# EAGLE design DIP_1_0 (EAGLE 8.3.2)
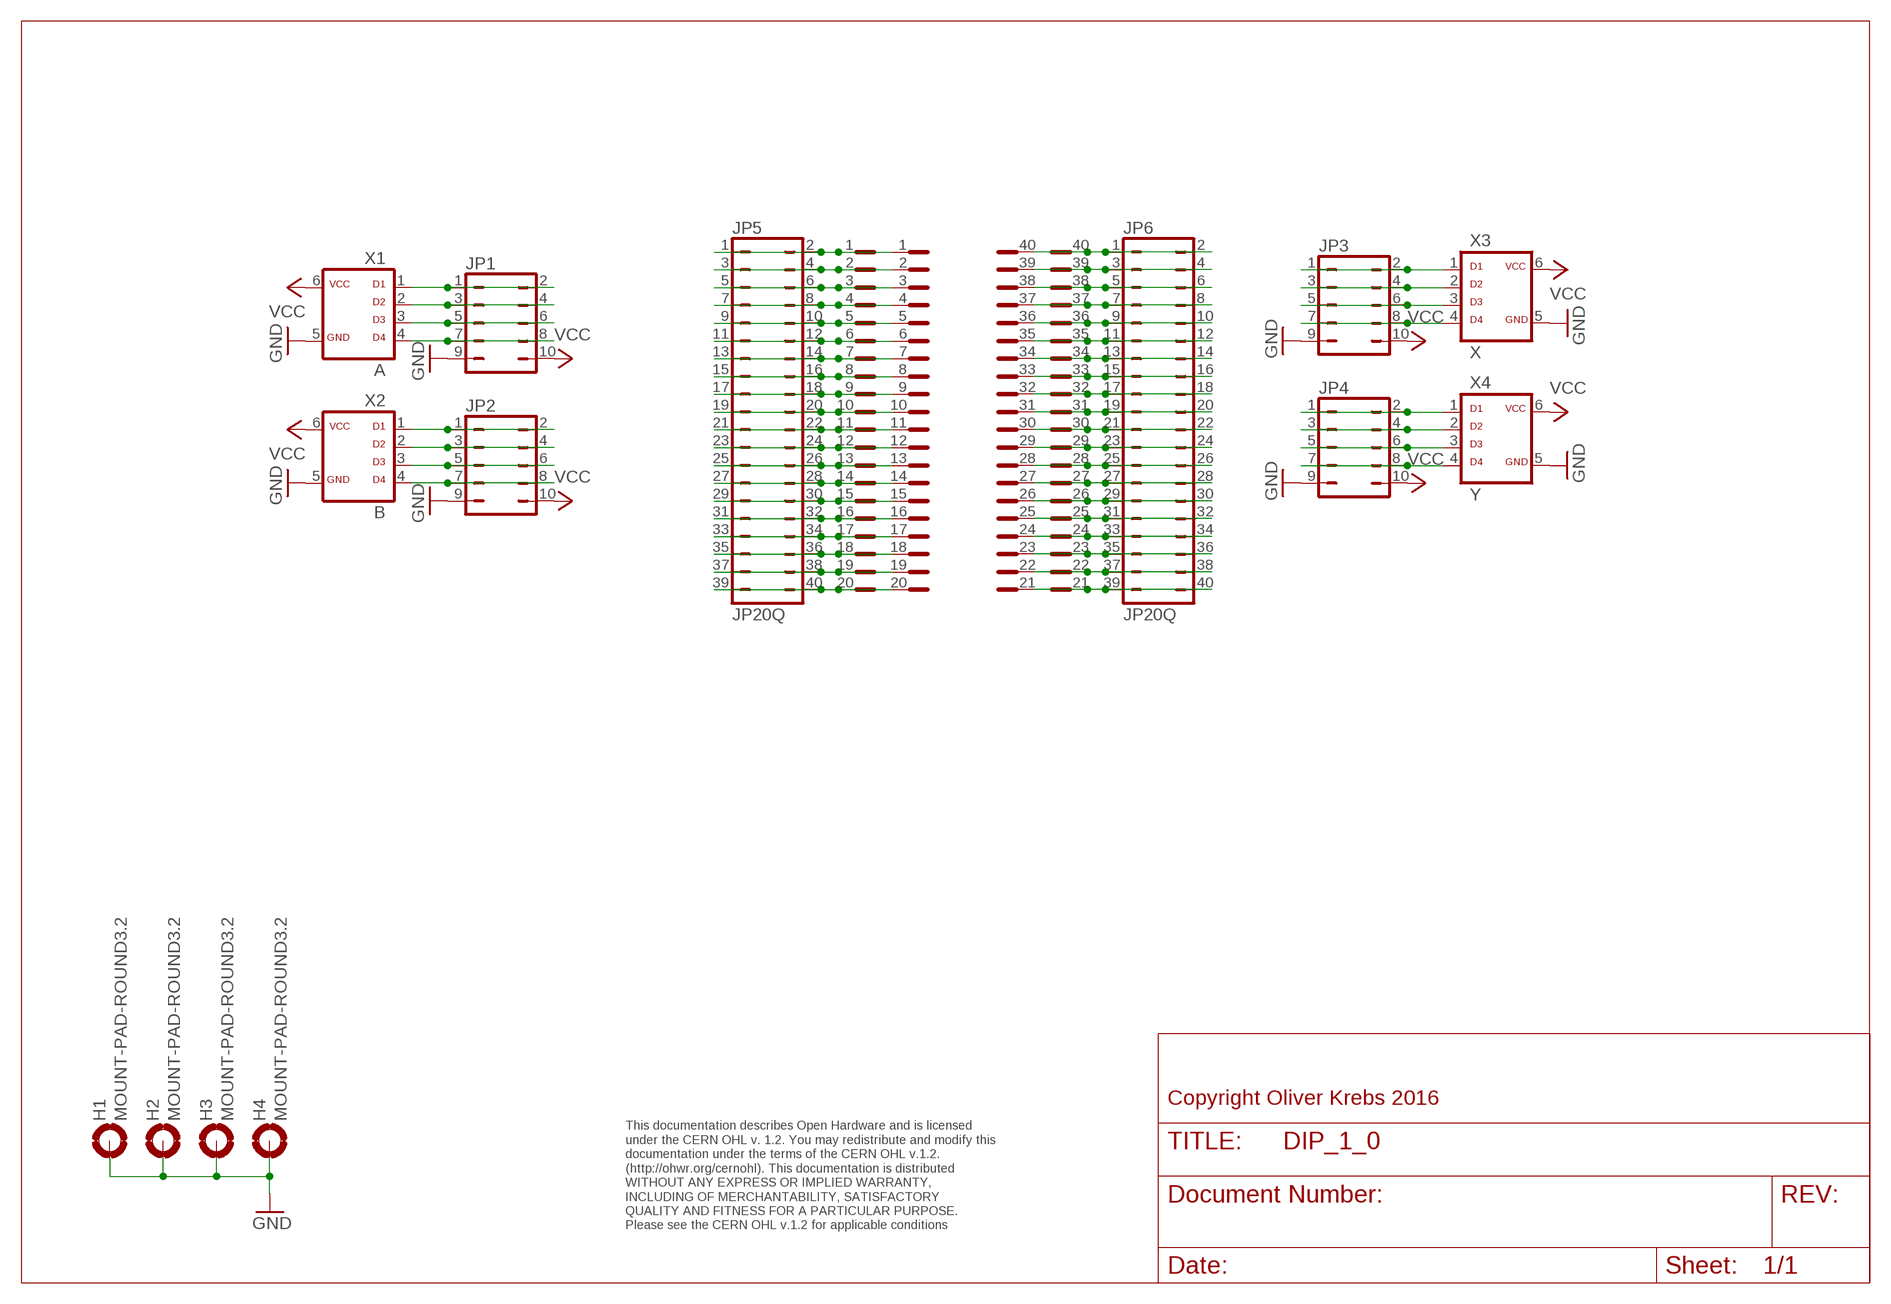
[diagram p0: schematic, sheet 1]

## Parts
H1  MOUNT-PAD-ROUND3.2  [3,2-PAD]
H2  MOUNT-PAD-ROUND3.2  [3,2-PAD]
H3  MOUNT-PAD-ROUND3.2  [3,2-PAD]
H4  MOUNT-PAD-ROUND3.2  [3,2-PAD]
JP1  JP5Q  [JP5Q]
JP2  JP5Q  [JP5Q]
JP3  JP5Q  [JP5Q]
JP4  JP5Q  [JP5Q]
JP5  JP20Q  [JP20Q]
JP6  JP20Q  [JP20Q]
X1  A  ML6D  [ML-6]
X2  B  ML6D  [ML-6]
X3  X  ML6D  [ML-6]
X4  Y  ML6D  [ML-6]
X5  DIL40-3  [DIL40-3]
X6  DIL40-6  [DIL40-6]

## Nets
GND: H1.B3,2(MOUNT) H2.B3,2(MOUNT) H3.B3,2(MOUNT) H4.B3,2(MOUNT) JP1.9 JP2.9 JP3.9 JP4.9 X1.5 X2.5 X3.5 X4.5
N$1: JP3.1 JP3.2 X3.1
N$2: JP3.3 JP3.4 X3.2
N$3: JP3.5 JP3.6 X3.3
N$4: JP3.7 JP3.8 X3.4
N$5: JP4.1 JP4.2 X4.1
N$6: JP4.3 JP4.4 X4.2
N$7: JP4.5 JP4.6 X4.3
N$8: JP4.7 JP4.8 X4.4
N$9: JP1.1 JP1.2 X1.1
N$10: JP1.3 JP1.4 X1.2
N$11: JP1.5 JP1.6 X1.3
N$12: JP1.7 JP1.8 X1.4
N$13: JP2.1 JP2.2 X2.1
N$14: JP2.3 JP2.4 X2.2
N$15: JP2.5 JP2.6 X2.3
N$16: JP2.7 JP2.8 X2.4
N$17: JP5.1 JP5.2 X5.1 X6.1
N$18: JP5.3 JP5.4 X5.2 X6.2
N$19: JP5.5 JP5.6 X5.3 X6.3
N$20: JP5.7 JP5.8 X5.4 X6.4
N$21: JP5.9 JP5.10 X5.5 X6.5
N$22: JP5.11 JP5.12 X5.6 X6.6
N$23: JP5.13 JP5.14 X5.7 X6.7
N$24: JP5.15 JP5.16 X5.8 X6.8
N$25: JP5.17 JP5.18 X5.9 X6.9
N$26: JP5.19 JP5.20 X5.10 X6.10
N$27: JP5.21 JP5.22 X5.11 X6.11
N$28: JP5.23 JP5.24 X5.12 X6.12
N$29: JP5.25 JP5.26 X5.13 X6.13
N$30: JP5.27 JP5.28 X5.14 X6.14
N$31: JP5.29 JP5.30 X5.15 X6.15
N$32: JP5.31 JP5.32 X5.16 X6.16
N$33: JP5.33 JP5.34 X5.17 X6.17
N$34: JP5.35 JP5.36 X5.18 X6.18
N$35: JP5.37 JP5.38 X5.19 X6.19
N$36: JP5.39 JP5.40 X5.20 X6.20
N$37: JP6.1 JP6.2 X5.40 X6.40
N$38: JP6.3 JP6.4 X5.39 X6.39
N$39: JP6.5 JP6.6 X5.38 X6.38
N$40: JP6.7 JP6.8 X5.37 X6.37
N$41: JP6.9 JP6.10 X5.36 X6.36
N$42: JP6.11 JP6.12 X5.35 X6.35
N$43: JP6.13 JP6.14 X5.34 X6.34
N$44: JP6.15 JP6.16 X5.33 X6.33
N$45: JP6.17 JP6.18 X5.32 X6.32
N$46: JP6.19 JP6.20 X5.31 X6.31
N$47: JP6.21 JP6.22 X5.30 X6.30
N$48: JP6.23 JP6.24 X5.29 X6.29
N$49: JP6.25 JP6.26 X5.28 X6.28
N$50: JP6.27 JP6.28 X5.27 X6.27
N$51: JP6.29 JP6.30 X5.26 X6.26
N$52: JP6.31 JP6.32 X5.25 X6.25
N$53: JP6.33 JP6.34 X5.24 X6.24
N$54: JP6.35 JP6.36 X5.23 X6.23
N$55: JP6.37 JP6.38 X5.22 X6.22
N$56: JP6.39 JP6.40 X5.21 X6.21
VCC: JP1.10 JP2.10 JP3.10 JP4.10 X1.6 X2.6 X3.6 X4.6

## Notes on the sheet
- Copyright Oliver Krebs 2016
- This documentation describes Open Hardware and is licensed 
  under the CERN OHL v. 1.2. You may redistribute and modify this 
  documentation under the terms of the CERN OHL v.1.2. 
  (http://ohwr.org/cernohl). This documentation is distributed
  WITHOUT ANY EXPRESS OR IMPLIED WARRANTY, 
  INCLUDING OF MERCHANTABILITY, SATISFACTORY 
  QUALITY AND FITNESS FOR A PARTICULAR PURPOSE. 
  Please see the CERN OHL v.1.2 for applicable conditions

## Library data of the parts
H1-H4 = holes:MOUNT-PAD-ROUND: MOUNTING PAD, round
JP1-JP4 = 01-my-jumper:JP5Q: JUMPER
JP5 JP6 = 01-my-con:JP20Q
X1-X4 = 01-my-con:ML6D
X5 X6 = 01-my-con:DIL40

## Board
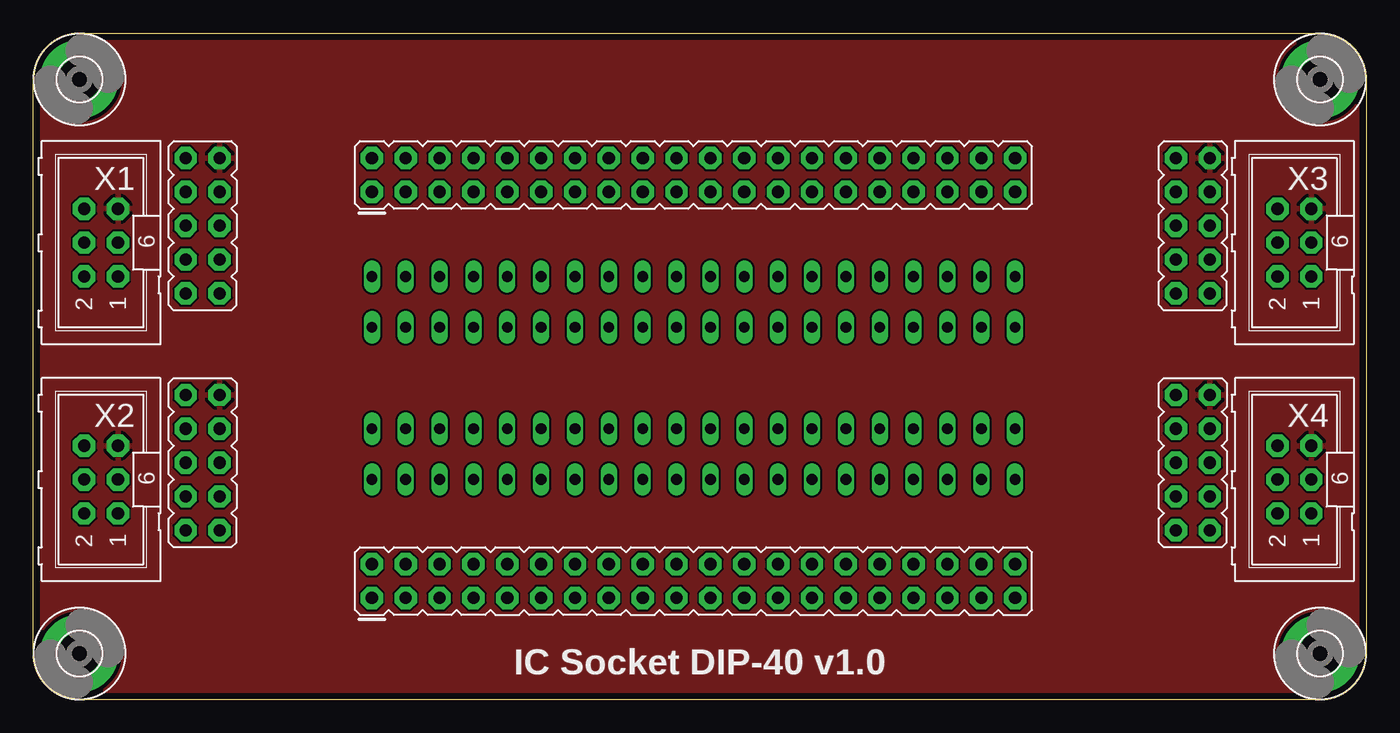
[diagram p1: board, top side]
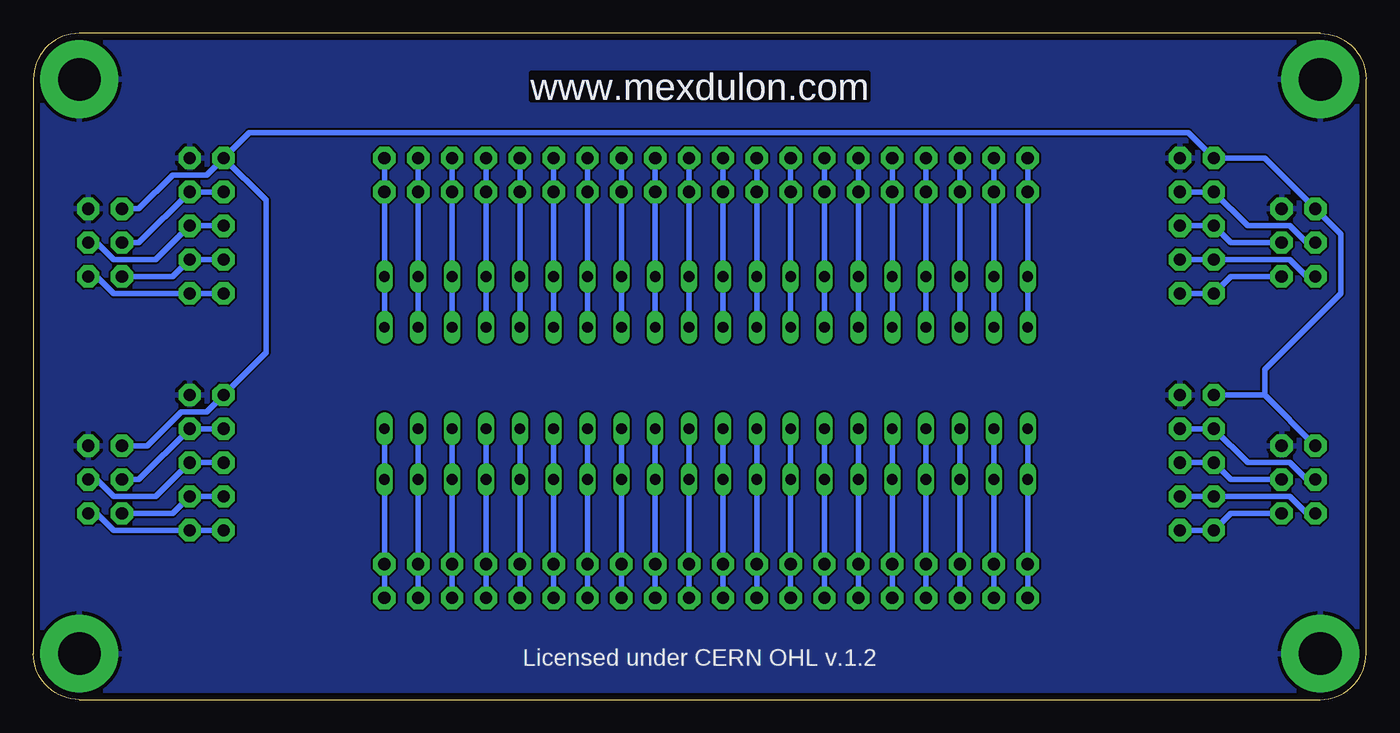
[diagram p2: board, bottom side, seen from below]

Size 100 x 50 mm. Coordinates in mm from the lower left corner, seen from the top.
Outline: 0,3.45 0,46.55 arc-90 3.45,50 96.55,50 arc-90 100,46.55 100,3.45 arc-90 96.55,0 3.45,0 arc-90 0,3.45
Copper layers (1*16): Top 0.035mm / dielectric 1.6mm / Bottom 0.035mm
Design rules "Elecrow_2-layer_PCB_eagle_rule": minimum track width 6mil, minimum drill 12mil, track to track 6mil, track to pad 6mil, pad to pad 6mil, via to via 8mil, smd to smd 0mil, copper to edge 20mil, drill to drill 10mil, minimum pad ring 6mil, minimum via ring 6mil, stop-mask expansion 0mil, vias tented up to drill 100mil, thermal gap 10mil

### Footprints (pad centres in the part's own frame; a part is rotated, then mirrored left to right if it is on the bottom)
3,2-PAD = drill 3.2 pad 5.842: B3,2 0,0
JP5Q = drill 0.914 pad 1.676 octagon: 1 -5.08,-1.27; 2 -5.08,1.27; 3 -2.54,-1.27; 4 -2.54,1.27; 5 0,-1.27; 6 0,1.27; 7 2.54,-1.27; 8 2.54,1.27; 9 5.08,-1.27; 10 5.08,1.27
JP20Q = drill 0.914 pad 1.676 octagon: 1 -24.13,-1.27; 2 -24.13,1.27; 3 -21.59,-1.27; 4 -21.59,1.27; 5 -19.05,-1.27; 6 -19.05,1.27; 7 -16.51,-1.27; 8 -16.51,1.27; 9 -13.97,-1.27; 10 -13.97,1.27; 11 -11.43,-1.27; 12 -11.43,1.27; 13 -8.89,-1.27; 14 -8.89,1.27; 15 -6.35,-1.27; 16 -6.35,1.27; 17 -3.81,-1.27; 18 -3.81,1.27; 19 -1.27,-1.27; 20 -1.27,1.27; 21 1.27,-1.27; 22 1.27,1.27; 23 3.81,-1.27; 24 3.81,1.27; 25 6.35,-1.27; 26 6.35,1.27; 27 8.89,-1.27; 28 8.89,1.27; 29 11.43,-1.27; 30 11.43,1.27; 31 13.97,-1.27; 32 13.97,1.27; 33 16.51,-1.27; 34 16.51,1.27; 35 19.05,-1.27; 36 19.05,1.27; 37 21.59,-1.27; 38 21.59,1.27; 39 24.13,-1.27; 40 24.13,1.27
ML-6 = drill 0.914 pad 1.676 octagon: 1 -2.54,-1.27; 2 -2.54,1.27; 3 0,-1.27; 4 0,1.27; 5 2.54,-1.27; 6 2.54,1.27
DIL40-3 = drill 0.813 long: 1 -24.13,-3.81; 2 -21.59,-3.81; 3 -19.05,-3.81; 4 -16.51,-3.81; 5 -13.97,-3.81; 6 -11.43,-3.81; 7 -8.89,-3.81; 8 -6.35,-3.81; 9 -3.81,-3.81; 10 -1.27,-3.81; 11 1.27,-3.81; 12 3.81,-3.81; 13 6.35,-3.81; 14 8.89,-3.81; 15 11.43,-3.81; 16 13.97,-3.81; 17 16.51,-3.81; 18 19.05,-3.81; 19 21.59,-3.81; 20 24.13,-3.81; 21 24.13,3.81; 22 21.59,3.81; 23 19.05,3.81; 24 16.51,3.81; 25 13.97,3.81; 26 11.43,3.81; 27 8.89,3.81; 28 6.35,3.81; 29 3.81,3.81; 30 1.27,3.81; 31 -1.27,3.81; 32 -3.81,3.81; 33 -6.35,3.81; 34 -8.89,3.81; 35 -11.43,3.81; 36 -13.97,3.81; 37 -16.51,3.81; 38 -19.05,3.81; 39 -21.59,3.81; 40 -24.13,3.81
DIL40-6 = drill 0.813 long: 1 -24.13,-7.62; 2 -21.59,-7.62; 3 -19.05,-7.62; 4 -16.51,-7.62; 5 -13.97,-7.62; 6 -11.43,-7.62; 7 -8.89,-7.62; 8 -6.35,-7.62; 9 -3.81,-7.62; 10 -1.27,-7.62; 11 1.27,-7.62; 12 3.81,-7.62; 13 6.35,-7.62; 14 8.89,-7.62; 15 11.43,-7.62; 16 13.97,-7.62; 17 16.51,-7.62; 18 19.05,-7.62; 19 21.59,-7.62; 20 24.13,-7.62; 21 24.13,7.62; 22 21.59,7.62; 23 19.05,7.62; 24 16.51,7.62; 25 13.97,7.62; 26 11.43,7.62; 27 8.89,7.62; 28 6.35,7.62; 29 3.81,7.62; 30 1.27,7.62; 31 -1.27,7.62; 32 -3.81,7.62; 33 -6.35,7.62; 34 -8.89,7.62; 35 -11.43,7.62; 36 -13.97,7.62; 37 -16.51,7.62; 38 -19.05,7.62; 39 -21.59,7.62; 40 -24.13,7.62

### Placement (x,y rotation side)
H1  3.45,3.45 0 top
H2  3.45,46.55 0 top
H3  96.55,46.55 0 top
H4  96.55,3.45 0 top
JP1  12.7,35.56 90 top
JP2  12.7,17.78 90 top
JP3  87,35.56 90 top
JP4  87,17.78 90 top
JP5  49.53,8.89 0 top
JP6  49.53,39.37 0 top
X1  5.08,34.29 90 top
X2  5.08,16.51 90 top
X3  94.61,34.29 90 top
X4  94.61,16.51 90 top
X5  49.53,24.13 0 top
X6  49.53,24.13 0 top

### Tracks (layer width: path | path; a pad name or v marks a point on that pad's centre or on a via)
GND
  pour Top: 0,50.16 100.97,50.16 100.97,0 0,0
  pour Bottom: 0,50.16 100.97,50.16 100.97,0 0,0
N$1
  Bottom 0.406: JP3.2 JP3.1 93.98,30.48 95.25,31.75 X3.1
N$2
  Bottom 0.406: JP3.4 JP3.3 89.53,31.75 X3.2
N$3
  Bottom 0.406: JP3.6 JP3.5 90.81,33.02 93.98,33.02 95.25,34.29 X3.3
N$4
  Bottom 0.406: JP3.8 JP3.7 92.08,34.29 X3.4
N$5
  Bottom 0.406: JP4.2 JP4.1 93.98,12.7 95.25,13.97 X4.1
N$6
  Bottom 0.406: JP4.4 JP4.3 89.53,13.97 X4.2
N$7
  Bottom 0.406: JP4.6 JP4.5 90.81,15.24 93.98,15.24 95.25,16.51 X4.3
N$8
  Bottom 0.406: JP4.8 JP4.7 92.08,16.51 X4.4
N$9
  Bottom 0.406: X1.1 10.16,31.75 JP1.2 JP1.1
N$10
  Bottom 0.406: X1.2 4.45,31.75 5.71,33.02 JP1.4 JP1.3
N$11
  Bottom 0.406: JP1.5 JP1.6 10.16,34.29 X1.3
N$12
  Bottom 0.406: X1.4 4.45,34.29 5.71,35.56 8.89,35.56 JP1.8 JP1.7
N$13
  Bottom 0.406: X2.1 10.16,13.97 JP2.2 JP2.1
N$14
  Bottom 0.406: X2.2 4.45,13.97 5.71,15.24 JP2.4 JP2.3
N$15
  Bottom 0.406: JP2.5 JP2.6 10.16,16.51 X2.3
N$16
  Bottom 0.406: X2.4 4.45,16.51 5.71,17.78 8.89,17.78 JP2.8 JP2.7
N$17
  Bottom 0.406: X5.1 X6.1 JP5.2 JP5.1
N$18
  Bottom 0.406: JP5.3 JP5.4 X6.2 X5.2
N$19
  Bottom 0.406: X5.3 X6.3 JP5.6 JP5.5
N$20
  Bottom 0.406: JP5.7 JP5.8 X6.4 X5.4
N$21
  Bottom 0.406: X5.5 X6.5 JP5.10 JP5.9
N$22
  Bottom 0.406: JP5.11 JP5.12 X6.6 X5.6
N$23
  Bottom 0.406: X5.7 X6.7 JP5.14 JP5.13
N$24
  Bottom 0.406: JP5.15 JP5.16 X6.8 X5.8
N$25
  Bottom 0.406: X5.9 X6.9 JP5.18 JP5.17
N$26
  Bottom 0.406: JP5.19 JP5.20 X6.10 X5.10
N$27
  Bottom 0.406: X5.11 X6.11 JP5.22 JP5.21
N$28
  Bottom 0.406: JP5.23 JP5.24 X6.12 X5.12
N$29
  Bottom 0.406: X5.13 X6.13 JP5.26 JP5.25
N$30
  Bottom 0.406: JP5.27 JP5.28 X6.14 X5.14
N$31
  Bottom 0.406: X5.15 X6.15 JP5.30 JP5.29
N$32
  Bottom 0.406: JP5.31 JP5.32 X6.16 X5.16
N$33
  Bottom 0.406: X5.17 X6.17 JP5.34 JP5.33
N$34
  Bottom 0.406: JP5.35 JP5.36 X6.18 X5.18
N$35
  Bottom 0.406: X5.19 X6.19 JP5.38 JP5.37
N$36
  Bottom 0.406: JP5.39 JP5.40 X6.20 X5.20
N$37
  Bottom 0.406: JP6.2 JP6.1 X6.40 X5.40
N$38
  Bottom 0.406: X5.39 X6.39 JP6.3 JP6.4
N$39
  Bottom 0.406: JP6.6 JP6.5 X6.38 X5.38
N$40
  Bottom 0.406: JP6.8 JP6.7 X6.37 X5.37
N$41
  Bottom 0.406: X5.36 X6.36 JP6.9 JP6.10
N$42
  Bottom 0.406: JP6.12 JP6.11 X6.35 X5.35
N$43
  Bottom 0.406: X5.34 X6.34 JP6.13 JP6.14
N$44
  Bottom 0.406: JP6.16 JP6.15 X6.33 X5.33
N$45
  Bottom 0.406: X5.32 X6.32 JP6.17 JP6.18
N$46
  Bottom 0.406: JP6.20 JP6.19 X6.31 X5.31
N$47
  Bottom 0.406: X5.30 X6.30 JP6.21 JP6.22
N$48
  Bottom 0.406: JP6.24 JP6.23 X6.29 X5.29
N$49
  Bottom 0.406: JP6.26 JP6.25 X6.28 X5.28
N$50
  Bottom 0.406: X5.27 X6.27 JP6.27 JP6.28
N$51
  Bottom 0.406: JP6.30 JP6.29 X6.26 X5.26
N$52
  Bottom 0.406: X5.25 X6.25 JP6.31 JP6.32
N$53
  Bottom 0.406: JP6.34 JP6.33 X6.24 X5.24
N$54
  Bottom 0.406: X5.23 X6.23 JP6.35 JP6.36
N$55
  Bottom 0.406: JP6.38 JP6.37 X6.22 X5.22
N$56
  Bottom 0.406: X5.21 X6.21 JP6.39 JP6.40
VCC
  Bottom 0.406: JP2.10 7.62,22.86 | 7.62,22.86 X2.6 | X4.6 91.44,19.05 88.9,21.59 87,21.59 JP4.10 82.55,26.04 82.55,37.47 JP3.10 | X3.6 92.08,36.83 89.53,39.37 87,39.37 JP3.10 | 7.62,22.86 7.62,24.77 1.91,30.48 1.91,34.92 X1.6 7.62,40.64 JP1.10 13.34,42.55 83.82,42.55 JP3.10

### Text on the board
Bottom: www.mexdulon.com
tNames: IC Socket DIP-40 v1.0
bNames: www.mexdulon.com | Licensed under CERN OHL v.1.2
tValues: + | - | + | - | 4 | 4 | 3 | 3 | 2 | 2 | 1 | 1 | + | - | + | - | 4 | 4 | 3 | 3 | 2 | 2 | 1 | 1
200bmp: E:/Bilder/Elektronik/Modulion/Mexdulon/mexdulon_50x50_pcb.bmp